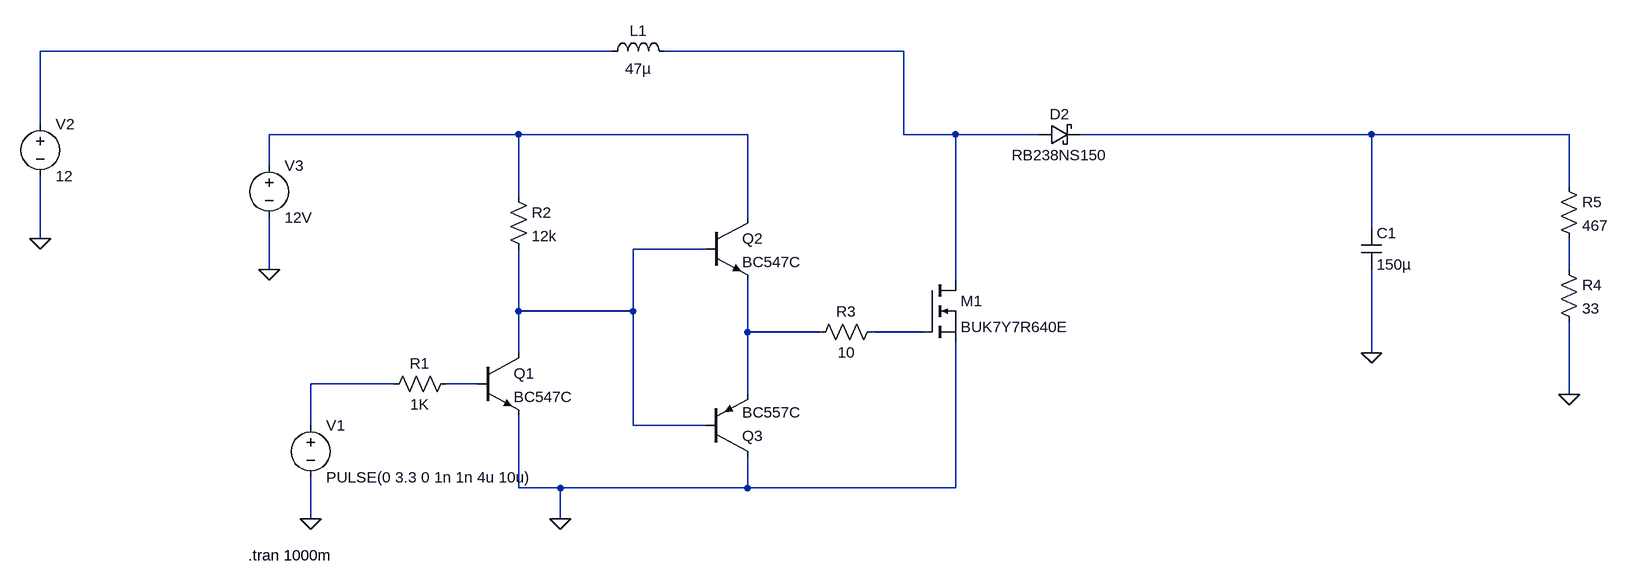
[diagram p0: schematic boost_converter.asc]
boost_converter.asc, the LTspice schematic file:
Version 4
SHEET 1 1560 1220
WIRE -240 -1024 -1120 -1024
WIRE 208 -1024 -160 -1024
WIRE -1120 -912 -1120 -1024
WIRE -384 -896 -768 -896
WIRE -32 -896 -384 -896
WIRE 208 -896 208 -1024
WIRE 288 -896 208 -896
WIRE 416 -896 288 -896
WIRE 928 -896 480 -896
WIRE 1232 -896 928 -896
WIRE -768 -848 -768 -896
WIRE 1232 -816 1232 -896
WIRE -384 -800 -384 -896
WIRE -32 -768 -32 -896
WIRE 928 -752 928 -896
WIRE -1120 -736 -1120 -832
WIRE -96 -720 -208 -720
WIRE -768 -688 -768 -768
WIRE 1232 -688 1232 -736
WIRE 288 -672 288 -896
WIRE -384 -624 -384 -720
WIRE -208 -624 -208 -720
WIRE -208 -624 -384 -624
WIRE -32 -592 -32 -672
WIRE 80 -592 -32 -592
WIRE 240 -592 160 -592
WIRE -384 -560 -384 -624
WIRE 928 -560 928 -688
WIRE -576 -512 -704 -512
WIRE -448 -512 -496 -512
WIRE -32 -496 -32 -592
WIRE 1232 -496 1232 -608
WIRE -704 -448 -704 -512
WIRE -208 -448 -208 -624
WIRE -96 -448 -208 -448
WIRE -384 -352 -384 -464
WIRE -320 -352 -384 -352
WIRE -32 -352 -32 -400
WIRE -32 -352 -320 -352
WIRE 288 -352 288 -576
WIRE 288 -352 -32 -352
WIRE -704 -304 -704 -368
WIRE -320 -304 -320 -352
FLAG -704 -304 0
FLAG -320 -304 0
FLAG -768 -688 0
FLAG 1232 -496 0
FLAG -1120 -736 0
FLAG 928 -560 0
SYMBOL voltage -704 -464 R0
WINDOW 123 0 0 Left 0
WINDOW 39 0 0 Left 0
SYMATTR InstName V1
SYMATTR Value PULSE(0 3.3 0 1n 1n 4u 10u)
SYMBOL res -480 -528 R90
WINDOW 0 0 56 VBottom 2
WINDOW 3 32 56 VTop 2
SYMATTR InstName R1
SYMATTR Value 1K
SYMBOL npn -448 -560 R0
SYMATTR InstName Q1
SYMATTR Value BC547C
SYMBOL npn -96 -768 R0
SYMATTR InstName Q2
SYMATTR Value BC547C
SYMBOL pnp -96 -400 M180
SYMATTR InstName Q3
SYMATTR Value BC557C
SYMBOL res -400 -816 R0
SYMATTR InstName R2
SYMATTR Value 12k
SYMBOL res 176 -608 R90
WINDOW 0 0 56 VBottom 2
WINDOW 3 32 56 VTop 2
SYMATTR InstName R3
SYMATTR Value 10
SYMBOL voltage -768 -864 R0
WINDOW 123 0 0 Left 0
WINDOW 39 0 0 Left 0
SYMATTR InstName V3
SYMATTR Value 12V
SYMBOL ind -256 -1008 R270
WINDOW 0 32 56 VTop 2
WINDOW 3 5 56 VBottom 2
SYMATTR InstName L1
SYMATTR Value 47µ
SYMATTR SpiceLine Ipk=24 Rser=0.0028 Rpar=0 Cpar=0
SYMBOL voltage -1120 -928 R0
WINDOW 123 0 0 Left 0
WINDOW 39 0 0 Left 0
SYMATTR InstName V2
SYMATTR Value 12
SYMBOL nmos 240 -672 R0
SYMATTR InstName M1
SYMATTR Value BUK7Y7R640E
SYMBOL cap 912 -752 R0
SYMATTR InstName C1
SYMATTR Value 150µ
SYMBOL schottky 416 -880 R270
WINDOW 0 32 32 VTop 2
WINDOW 3 0 32 VBottom 2
SYMATTR InstName D2
SYMATTR Value RB238NS150
SYMATTR Description Diode
SYMATTR Type diode
SYMBOL res 1216 -704 R0
SYMATTR InstName R4
SYMATTR Value 33
SYMBOL res 1216 -832 R0
SYMATTR InstName R5
SYMATTR Value 467
TEXT -800 -248 Left 2 !.tran 1000m

The netlist it stands for:
* boost_converter.asc
V1 N009 0 PULSE(0 3.3 0 1n 1n 4u 10u)
R1 N010 N009 1K
Q1 N005 N010 0 0 BC547C
Q2 N003 N005 N007 0 BC547C
Q3 0 N005 N007 0 BC557C
R2 N003 N005 12k
R3 N008 N007 10
V3 N003 0 12V
L1 N001 N002 47µ Ipk=24 Rser=0.0028 Rpar=0 Cpar=0
V2 N001 0 12
M1 N002 N008 0 0 BUK7Y7R640E
C1 N004 0 150µ
D2 N002 N004 RB238NS150
R4 N006 0 33
R5 N004 N006 467
.model D D
.lib standard.dio
.model NPN NPN
.model PNP PNP
.lib standard.bjt
.model NMOS NMOS
.model PMOS PMOS
.lib standard.mos
.tran 1000m
.backanno
.end